# EAGLE design Carrier-Board-CM740 (EAGLE 9.6.2)
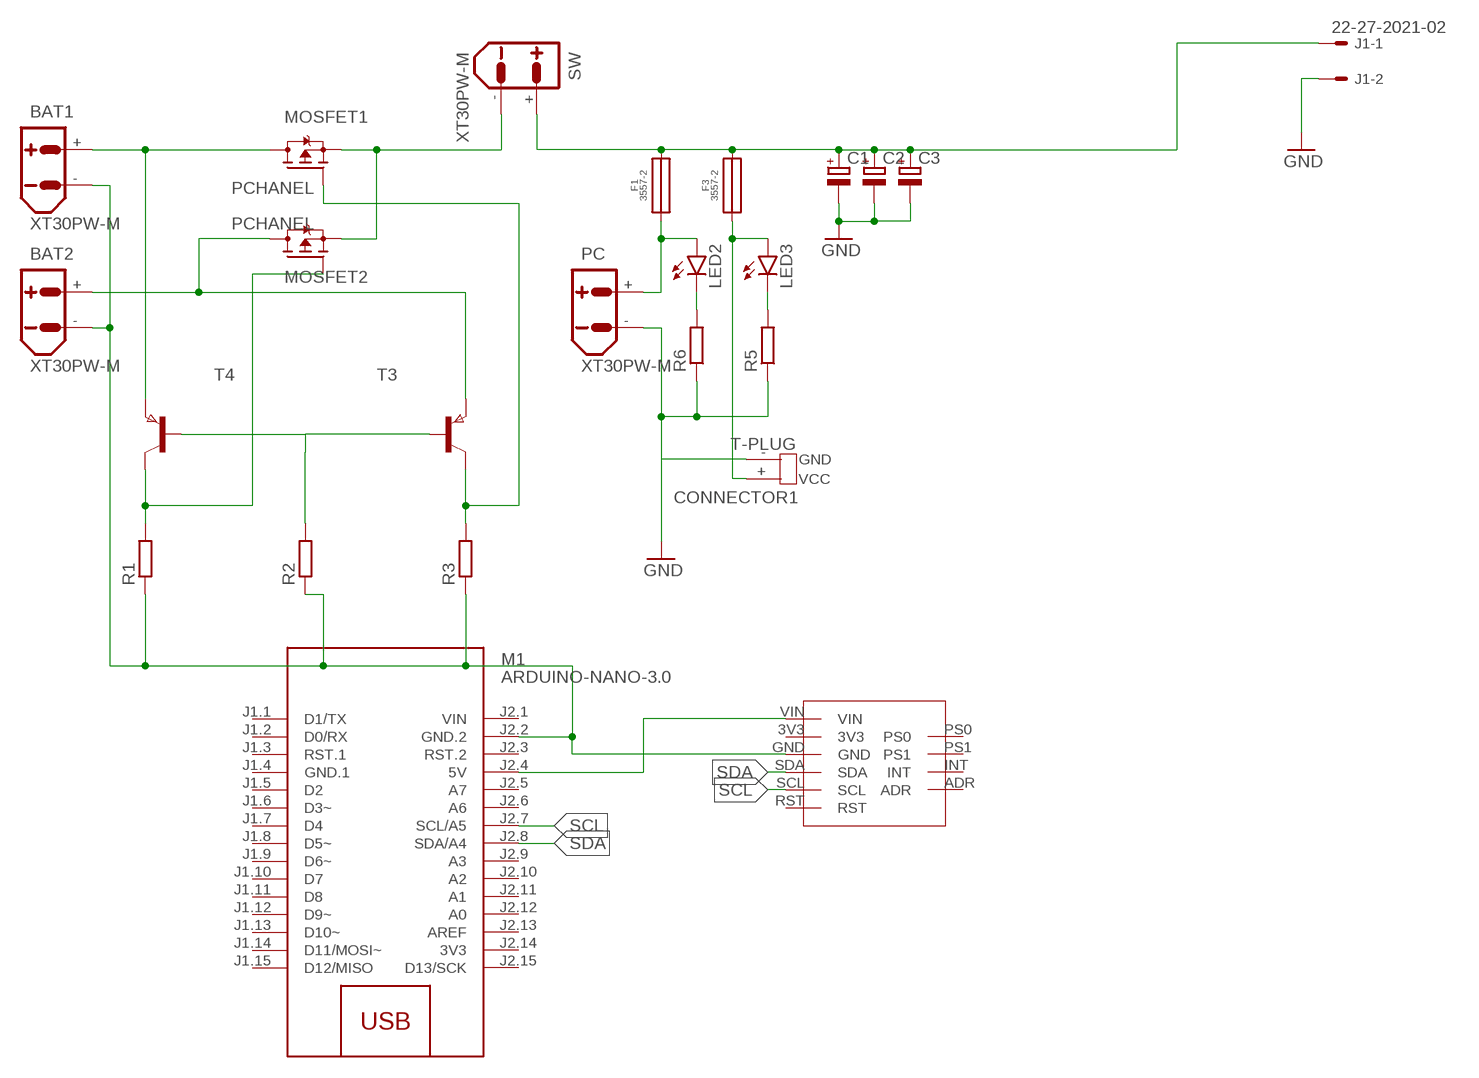
[diagram p0: schematic, sheet 1]

## Parts
BAT1  XT30PW-M  [XT30PW-M]
BAT2  XT30PW-M  [XT30PW-M]
C1  CPOL-EU150CLZ-1014  [150CLZ-1014]
C2  CPOL-EU150CLZ-1014  [150CLZ-1014]
C3  CPOL-EU150CLZ-1014  [150CLZ-1014]
CONNECTOR1  T-PLUG  [T-PLUG]
F1  3557-2  [3557-2]
F3  3557-2  [3557-2]
J1  22-27-2021-02  [6410-02]
LED2  LEDCHIP-LED0805  [CHIP-LED0805]
LED3  LEDCHIP-LED0805  [CHIP-LED0805]
M1  ARDUINO-NANO-3.0  [ARDUINO-NANO-3.0]
MOSFET1  PCHANEL  FDD4141TO252  [TO252]
MOSFET2  PCHANEL  FDD4141TO252  [TO252]
PC  XT30PW-M  [XT30PW-M]
R1  R-EU_R1206  [R1206]
R2  R-EU_R1206  [R1206]
R3  R-EU_R1206  [R1206]
R5  R-EU_M0805  [M0805]
R6  R-EU_M0805  [M0805]
SW  XT30PW-M  [XT30PW-M]
T3  PNPSOT23  [SOT-23]
T4  PNPSOT23  [SOT-23]
U$1  BNO055_BNO055  [BNO055_BNO055]

## Nets
GND: BAT1.- BAT2.- C1.- C2.- C3.- CONNECTOR1.-(GND) J1.2 M1.J2.2(GND.2) PC.- R1.1 R2.1 R3.1 R5.1 R6.1 U$1.GND
N$1: BAT1.+ MOSFET1.3(D) T4.2(E)
N$2: MOSFET2.1(G) R1.2 T4.1(C)
N$3: R2.2 T3.3(B) T4.3(B)
N$5: F1.1 F1.2 LED2.A PC.+
N$6: M1.J2.4(5V) U$1.VIN
N$8: C1.+ C2.+ C3.+ F1.3 F1.4 F3.3 F3.4 J1.1 SW.+
N$9: MOSFET1.1(G) R3.2 T3.1(C)
N$10: BAT2.+ MOSFET2.3(D) T3.2(E)
N$11: LED2.C R6.2
N$12: MOSFET1.2(S) MOSFET2.2(S) SW.-
N$13: LED3.C R5.2
SCL: M1.J2.7(SCL/A5) U$1.SCL
SDA: M1.J2.8(SDA/A4) U$1.SDA
VCC: CONNECTOR1.+(VCC) F3.1 F3.2 LED3.A
Unconnected: M1.J1.1(D1/TX) M1.J1.2(D0/RX) M1.J1.3(RST.1) M1.J1.5(D2) M1.J1.6(D3~) M1.J1.7(D4) M1.J1.8(D5~) M1.J1.9(D6~) M1.J1.10(D7) M1.J1.11(D8) M1.J1.12(D9~) M1.J1.13(D10~) M1.J1.14(D11/MOSI~) M1.J1.15(D12/MISO) M1.J2.3(RST.2) M1.J2.5(A7) M1.J2.6(A6) M1.J2.9(A3) M1.J2.10(A2) M1.J2.11(A1) M1.J2.12(A0) M1.J2.13(AREF) M1.J2.15(D13/SCK) U$1.3V3 U$1.ADR U$1.INT U$1.PS0 U$1.PS1 U$1.RST

## Power pins joined to a net without a drawn wire
3V3: M1.J2.14(3V3)
GND.1: M1.J1.4(GND.1)
VIN: M1.J2.1(VIN)

## Library data of the parts
BAT1 BAT2 PC SW = amass:XT30: AMASS XT30 connector Store in Japan AMASS XT30 connector <https://szc.jp/ams-xt30>
C1-C3 = resistor12:CPOL-EU: POLARIZED CAPACITOR, European symbol
CONNECTOR1 = T-PLUG:T-PLUG
F1 F3 = 3557-2:3557-2
J1 = con-molex:22-?-02: CONNECTOR wire to board 2.54 mm (.1 inch) pitch header; MF: MOLEX; OC_FARNELL: unknown; OC_NEWARK: unknown
LED2 LED3 = led:LED: LED OSRAM: - CHIPLED LG R971, LG N971, LY N971, LG Q971, LY Q971, LO R971, LY R971 LH N974, LH R974 LS Q976, LO Q976, LY Q976 LO Q996 - Hyper CHIPLED LW Q18S LB Q993, LB Q99A, LB R99A - SideLED LS A670, LO A670, LY A670, LG A670, LP A670 LB A673, LV A673, LT A673, LW A673 LH A674 LY A675 LS A676, LA A676, LO A676, LY A676, LW A676 LS A679, LY A679, LG A679 - Hyper Micro SIDELED® LS Y876, LA Y876, LO Y876, LY Y876 LT Y87S - SmartLED LW L88C, LW L88S LB L89C, LB L89S, LG L890 LS L89K, LO L89K, LY L89K LS L896, LA L896, LO L896, LY L896 - TOPLED LS T670, LO T670, LY T670, LG T670, LP T670 LSG T670, LSP T670, LSY T670, LOP T670, LYG T670 LG T671, LOG T671, LSG T671 LB T673, LV T673, LT T673, LW T673 LH T674 LS T676, LA T676, LO T676, LY T676, LB T676, LH T676, LSB T676, LW T676 LB T67C, LV T67C, LT T67C, LS T67K, LO T67K, LY T67K, LW E67C LS E67B, LA E67B, LO E67B, LY E67B, LB E67C, LV E67C, LT E67C LW T67C LS T679, LY T679, LG T679 LS T770, LO T770, LY T770, LG T770, LP T770 LB T773, LV T773, LT T773, LW T773 LH T774 LS E675, LA E675, LY E675, LS T675 LS T776, LA T776, LO T776, LY T776, LB T776 LHGB T686 LT T68C, LB T68C - Hyper Mini TOPLED® LB M676 - Mini TOPLED Santana® LG M470 LS M47K, LO M47K, LY M47K Source: http://www.osram.convergy.de LUXEON: - LUMILED® LXK2-PW12-R00, LXK2-PW12-S00, LXK2-PW14-U00, LXK2-PW14-V00 LXK2-PM12-R00, LXK2-PM12-S00, LXK2-PM14-U00 LXK2-PE12-Q00, LXK2-PE12-R00, LXK2-PE12-S00, LXK2-PE14-T00, LXK2-PE14-U00 LXK2-PB12-K00, LXK2-PB12-L00, LXK2-PB12-M00, LXK2-PB14-N00, LXK2-PB14-P00, LXK2-PB14-Q00 LXK2-PR12-L00, LXK2-PR12-M00, LXK2-PR14-Q00, LXK2-PR14-R00 LXK2-PD12-Q00, LXK2-PD12-R00, LXK2-PD12-S00 LXK2-PH12-R00, LXK2-PH12-S00 LXK2-PL12-P00, LXK2-PL12-Q00, LXK2-PL12-R00 Source: www.luxeon.com KINGBRIGHT: KA-3528ASYC Source: www.kingbright.com
M1 = diy-modules:ARDUINO-NANO-3.0: Arduino Nano 3.0 and compatible devices More details available here: https://www.arduino.cc/en/Main/ArduinoBoardNano Click here to find device on ebay.com <http://www.ebay.com/sch/arduino+nano>
MOSFET1 MOSFET2 = transistor-fet:FDD4141: P-Channel PowerTrench® MOSFET Source: FDD4141.pdf
R1-R3 R5 R6 = rcl:R-EU_: RESISTOR, European symbol; SPICEPREFIX: R
T3 T4 = zetex:PNPSOT23: PNP TRANSISTOR; MPN: DSS20200L-7; OC_FARNELL: unknown; OC_NEWARK: 25R4554
U$1 = CM FT4232 with RS485 and ESP32:BNO055_BNO055

## Board
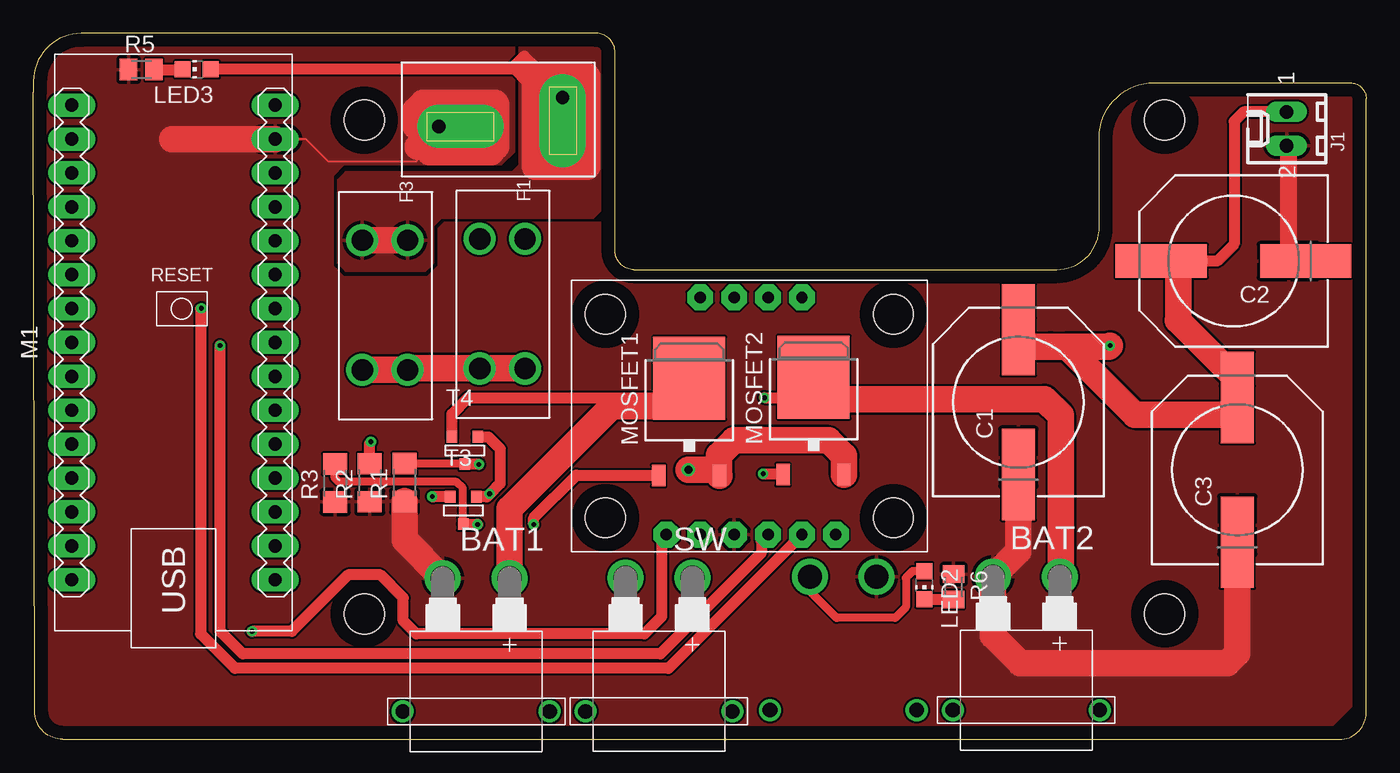
[diagram p1: board, top side]
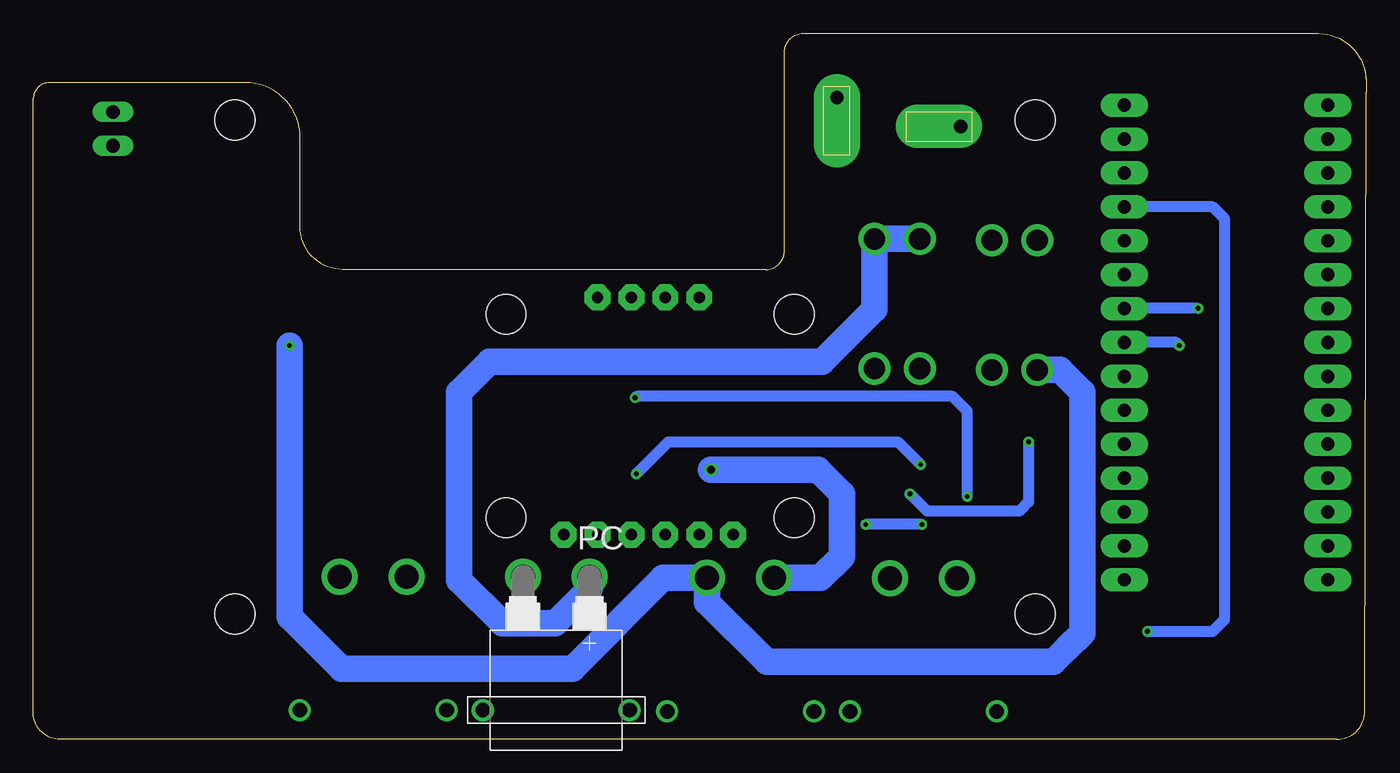
[diagram p2: board, bottom side, seen from below]

Size 99.9 x 52.9 mm. Coordinates in mm from the lower left corner, seen from the top.
Outline: 2.2,0 97.9,0 arc90 99.9,2 99.9,48 arc90 98.7,49.2 84,49.2 arc90 79.9,45.1 79.9,38.4 arc-90 76.7,35.2 45,35.2 arc-90 43.6,36.6 43.6,51.5 arc90 42.2,52.9 3.6,52.9 arc90 0,49.3 0,48.5 0.1,2.3 0.1,2.1 arc90 2.2,0
Outline: 29.5,47 34.5,47 34.5,44.8 29.5,44.8 29.5,47
Outline: 38.7,48.9 40.7,48.9 40.7,43.8 38.7,43.8 38.7,48.9
Copper layers (1*16): Top 0.035mm / dielectric 1.5mm / Bottom 0.035mm
Design rules "default": minimum track width 6mil, minimum drill 0.35mm, track to track 6mil, track to pad 6mil, pad to pad 6mil, via to via 6mil, smd to smd 6mil, copper to edge 40mil, drill to drill 6mil, minimum pad ring 10mil, minimum via ring 8mil, stop-mask expansion 4mil, vias tented up to drill 0mil, thermal gap 10mil
Holes 3 mm at 24.8,9.4 84.8,9.4 24.8,46.4 84.8,46.4
Milling: 8 lines

### Footprints (pad centres in the part's own frame; a part is rotated, then mirrored left to right if it is on the bottom)
XT30PW-M = drill 1.8: + -2.5,0; - 2.5,0 | drill 1.1: P$3 -5.5,10; P$4 5.5,10
150CLZ-1014 = smd 4.3 x 2.5: + 4.15,0; +1 6.69,0; - -4.15,0; -1 -4.15,0; -2 -6.69,0
T-PLUG = drill 1 pad 3.5 offset: + 3.9,0.43 | drill 1 pad 3.25 offset: - 1.73,9.7
3557-2 = drill 1.6: 1 3.603,5.154; 2 3.603,1.754; 3 13.311,5.154; 4 13.311,1.754
6410-02 = drill 1.016 long: 1 1.27,0; 2 -1.27,0
CHIP-LED0805 = smd 1.2 x 1.2: A 0,-1.05; C 0,1.05
ARDUINO-NANO-3.0 = drill 1 pad 1.778 long: J1.1 17.78,7.62; J1.2 15.24,7.62; J1.3 12.7,7.62; J1.4 10.16,7.62; J1.5 7.62,7.62; J1.6 5.08,7.62; J1.7 2.54,7.62; J1.8 0,7.62; J1.9 -2.54,7.62; J1.10 -5.08,7.62; J1.11 -7.62,7.62; J1.12 -10.16,7.62; J1.13 -12.7,7.62; J1.14 -15.24,7.62; J1.15 -17.78,7.62; J2.1 17.78,-7.62; J2.2 15.24,-7.62; J2.3 12.7,-7.62; J2.4 10.16,-7.62; J2.5 7.62,-7.62; J2.6 5.08,-7.62; J2.7 2.54,-7.62; J2.8 0,-7.62; J2.9 -2.54,-7.62; J2.10 -5.08,-7.62; J2.11 -7.62,-7.62; J2.12 -10.16,-7.62; J2.13 -12.7,-7.62; J2.14 -15.24,-7.62; J2.15 -17.78,-7.62
TO252 = smd 1 x 1.6: 1 -2.28,-4.8; 2 2.28,-4.8 | smd 5.4 x 6.2: 3 0,2.5
R1206 = smd 1.6 x 1.803: 1 -1.422,0; 2 1.422,0
M0805 = smd 1.3 x 1.6: 1 -0.95,0; 2 0.95,0
SOT-23 = smd 0.787 x 0.889: 1 0.025,-1.016; 2 -0.94,1.016; 3 0.991,1.016
BNO055_BNO055 = drill 0.85 pad 1.93 octagon: 3V3 9.652,1.27; ADR 17.272,19.05; GND 12.192,1.27; INT 14.732,19.05; PS0 9.652,19.05; PS1 12.192,19.05; RST 19.812,1.27; SCL 17.272,1.27; SDA 14.732,1.27; VIN 7.112,1.27 | hole 3: 2.54,2.54; 2.54,17.78; 24.13,2.54; 24.13,17.78

### Placement (x,y rotation side)
BAT1  33.19,12.09 180 top
BAT2  74.43,12.19 180 top
C1  73.83,25.27 90 top
C2  89.96,35.84 180 top
C3  90.24,20.19 90 top
CONNECTOR1  40.1,44.2 90 top
F1  31.7,41.1 270 top
F3  22.9,41 270 top
J1  93.94,45.75 90 top
LED2  66.78,11.55 180 top
LED3  12.25,50.2 90 top
M1  10.5,29.74 90 top
MOSFET1  49.15,24.56 0 top
MOSFET2  58.48,24.64 0 top
PC  60.71,12.19 180 bottom
R1  27.82,19.25 90 top
R2  25.22,19.23 90 top
R3  22.62,19.21 90 top
R5  8.09,50.18 0 top
R6  68.98,11.43 270 top
SW  46.89,12.1 180 top
T3  32.2,17.15 0 top
T4  32.31,21.65 0 top
U$1  40.34,14.07 0 top

### Tracks (layer width: path | path; a pad name or v marks a point on that pad's centre or on a via)
GND
  Top 0.152: M1.J2.2 18.14,45 20.4,45 22.1,43.3 28.7,43.3 29.11,43.71 29.05,43.71 28.83,43.93 | 28.8,44.4 28.2,43.8
  Top 1.27: C2.- 94.11,44.31 J1.2
  Top 2: M1.J2.2 10.39,44.98 | CONNECTOR1.- 28.67,45.93 28.6,46 28.6,47.1 29.2,47.7 34.6,47.7 34.7,47.6 34.7,44.4 34.3,44 29.7,44 29.3,44.4 28.8,44.4 | C1.- 73.83,14.09 BAT2.- 71.93,7.77 74,5.7 89.5,5.7 90.24,6.44 C3.- | R1.1 27.82,14.96 BAT1.-
  pour Top: 36.1,52.5 36.1,44 35.1,43 23.3,43 22.5,42.2 22.5,35.5 23.3,34.7 29.5,34.7 30.3,35.5 30.3,38.3 30.8,38.8 42.7,38.8 43.2,38.3 43.2,36.1 44.6,34.7 78.3,34.7 80.6,37 80.6,46.3 80.5,46.4 82.8,48.7 98.5,48.7 99.6,47.6 99.6,3.2 96.5,0.1 2.2,0.1 0,2.3 0,49.8 3,52.8 35.8,52.8
N$1
  Top 0.813: T4.2 31.37,24.37 32.6,25.6 48.6,25.6 49.15,26.15 MOSFET1.3
  Top 2: BAT1.+ 35.69,17.29 43.36,24.96 47.05,24.96 MOSFET1.3
N$2  (via drill 0.35)
  Top 0.61: T4.1 27.86,20.63 R1.2
  Top 0.813: T4.1 33.37,20.63 v33.4,20.6 | 56.1,19.94 MOSFET2.1 56.14,19.9 v54.7,19.9
  Bottom 0.813: v54.7,19.9 52.3,22.3 35.1,22.3 v33.4,20.6
N$3  (via drill 0.35)
  Top 0.813: T4.3 34.1,22.67 35,21.77 35,19.18 34.2,18.38 | T3.3 33.99,18.17 34.2,18.38 | R2.2 25.22,22.22 v25.3,22.3 | v34.2,18.4 34.2,18.38
  Bottom 0.813: v25.3,22.3 25.3,17.8 26,17.1 32.9,17.1 v34.2,18.4
N$5
  Top 0.61: LED2.A 65.9,12.6 65.4,12.1 65.4,9.9 64.6,9.1 60.2,9.1 58.21,11.09 PC.+
  Bottom 2: F1.2 F1.1 36.85,32.25 40.8,28.3 65.7,28.3 67.99,26.01 67.99,11.93 64.75,8.69 60.81,8.69 58.21,11.29 PC.+
N$6  (via drill 0.35)
  Top 0.813: U$1.VIN 47.1,14.99 47.1,9.2 45.8,7.9 28.7,7.9 27.72,8.88 27.72,10.61 26.01,12.32 23.59,12.32 19.37,8.1 v16.4,8.1
  Bottom 0.813: v16.4,8.1 11.5,8.1 10.6,9 10.6,39 11.5,39.9 M1.J2.4
N$8  (via drill 0.35)
  Top 0.813: J1.1 90.72,47.02 90,46.3 90,37.1 88.74,35.84 85.98,35.84 | 85.98,35.84 85.98,35.8 | C2.+ 85.98,35.84
  Top 2: F1.3 F1.4 28.15,27.79 F3.3 F3.4 | C1.+ 76.23,29.42 77.48,29.42 | 77.48,29.42 82.56,24.34 C3.+ 90.24,26.96 85.8,31.4 85.81,31.41 C2.+ | v80.7,29.5 80.62,29.42 77.48,29.42
  Bottom 1.27: 21.28,7.94 21.04,8.18 | 21.28,9.9 21.28,9.37
  Bottom 2: F3.4 22.95,27.69 21.28,26.02 21.28,9.9 21.28,7.94 22.41,6.81 23.43,5.8 44.9,5.8 49.39,10.29 SW.+ 52.7,12.1 59.5,5.3 76.8,5.3 80.7,9.2 v80.7,29.5
N$9  (via drill 0.35)
  Top 0.61: T3.1 32.2,16.16 32.2,18.8 31.7,19.3 22.9,19.3 22.6,19.6 22.6,20.61 R3.2
  Top 0.813: T3.1 33.27,16.13 v33.3,16.1 | v37.5,16.1 37.5,16.6 40.7,19.8 46.83,19.8 MOSFET1.1
  Bottom 0.813: v33.3,16.1 v37.5,16.1
N$10  (via drill 0.35)
  Top 0.813: T3.2 29.93,18.17 v29.9,18.2 | v54.8,25.6 56.94,25.6 MOSFET2.3
  Top 2: MOSFET2.3 60.12,25.5 75.8,25.5 77,24.3 77,12.26 BAT2.+
  Bottom 0.813: v29.9,18.2 29.9,24.6 31,25.7 54.7,25.7 v54.8,25.6
N$11
  Top 0.813: LED2.C 68.96,10.5 R6.2
N$12  (via drill 0.6)
  Top 2: MOSFET2.2 60.76,21.24 59.6,22.4 52.5,22.4 51.4,21.3 51.4,19.79 MOSFET1.2 50.99,20.2 v49.1,20.2
  Bottom 2: SW.- 40.9,12.1 39.3,13.7 39.3,18.4 41.1,20.2 v49.1,20.2
N$13
  Top 0.813: R5.2 11.18,50.18 LED3.C
SCL  (via drill 0.35)
  Top 0.813: U$1.SCL 47.59,5.32 15.11,5.32 12.54,7.9 12.54,32.23 v12.6,32.3
  Bottom 0.813: v12.6,32.3 18.1,32.3 M1.J2.7
SDA  (via drill 0.35)
  Top 0.813: U$1.SDA 54.57,14.84 54.57,13.97 47,6.4 15.7,6.4 14,8.1 v14,29.5
  Bottom 0.813: v14,29.5 14.24,29.74 M1.J2.8
VCC
  Top 0.813: CONNECTOR1.+ 37.57,50.2 36.1,50.2 | 36.1,50.2 LED3.A | 36.1,50.2 36.9,49.4 37.75,50.25 36.8,51.2 36.1,50.5 36.1,50.2
  Top 2: F3.2 F3.1 | CONNECTOR1.+ 39.67,49.7 | 39.67,49.7 41.5,49.7 41.5,42.9 37.6,42.9 37.6,49.7 39.67,49.7
  pour Top: 36.4,52.8 36.4,43 35.9,42.5 23.4,42.5 22.8,41.9 22.8,35.7 23.4,35.1 29.4,35.1 30,35.7 30,38.5 30.3,38.8 30.6,39.1 42,39.1 43.1,40.2 43.1,40.3 43.1,52.1 42.4,52.8